# EAGLE design HIZ (EAGLE 7.3.0)
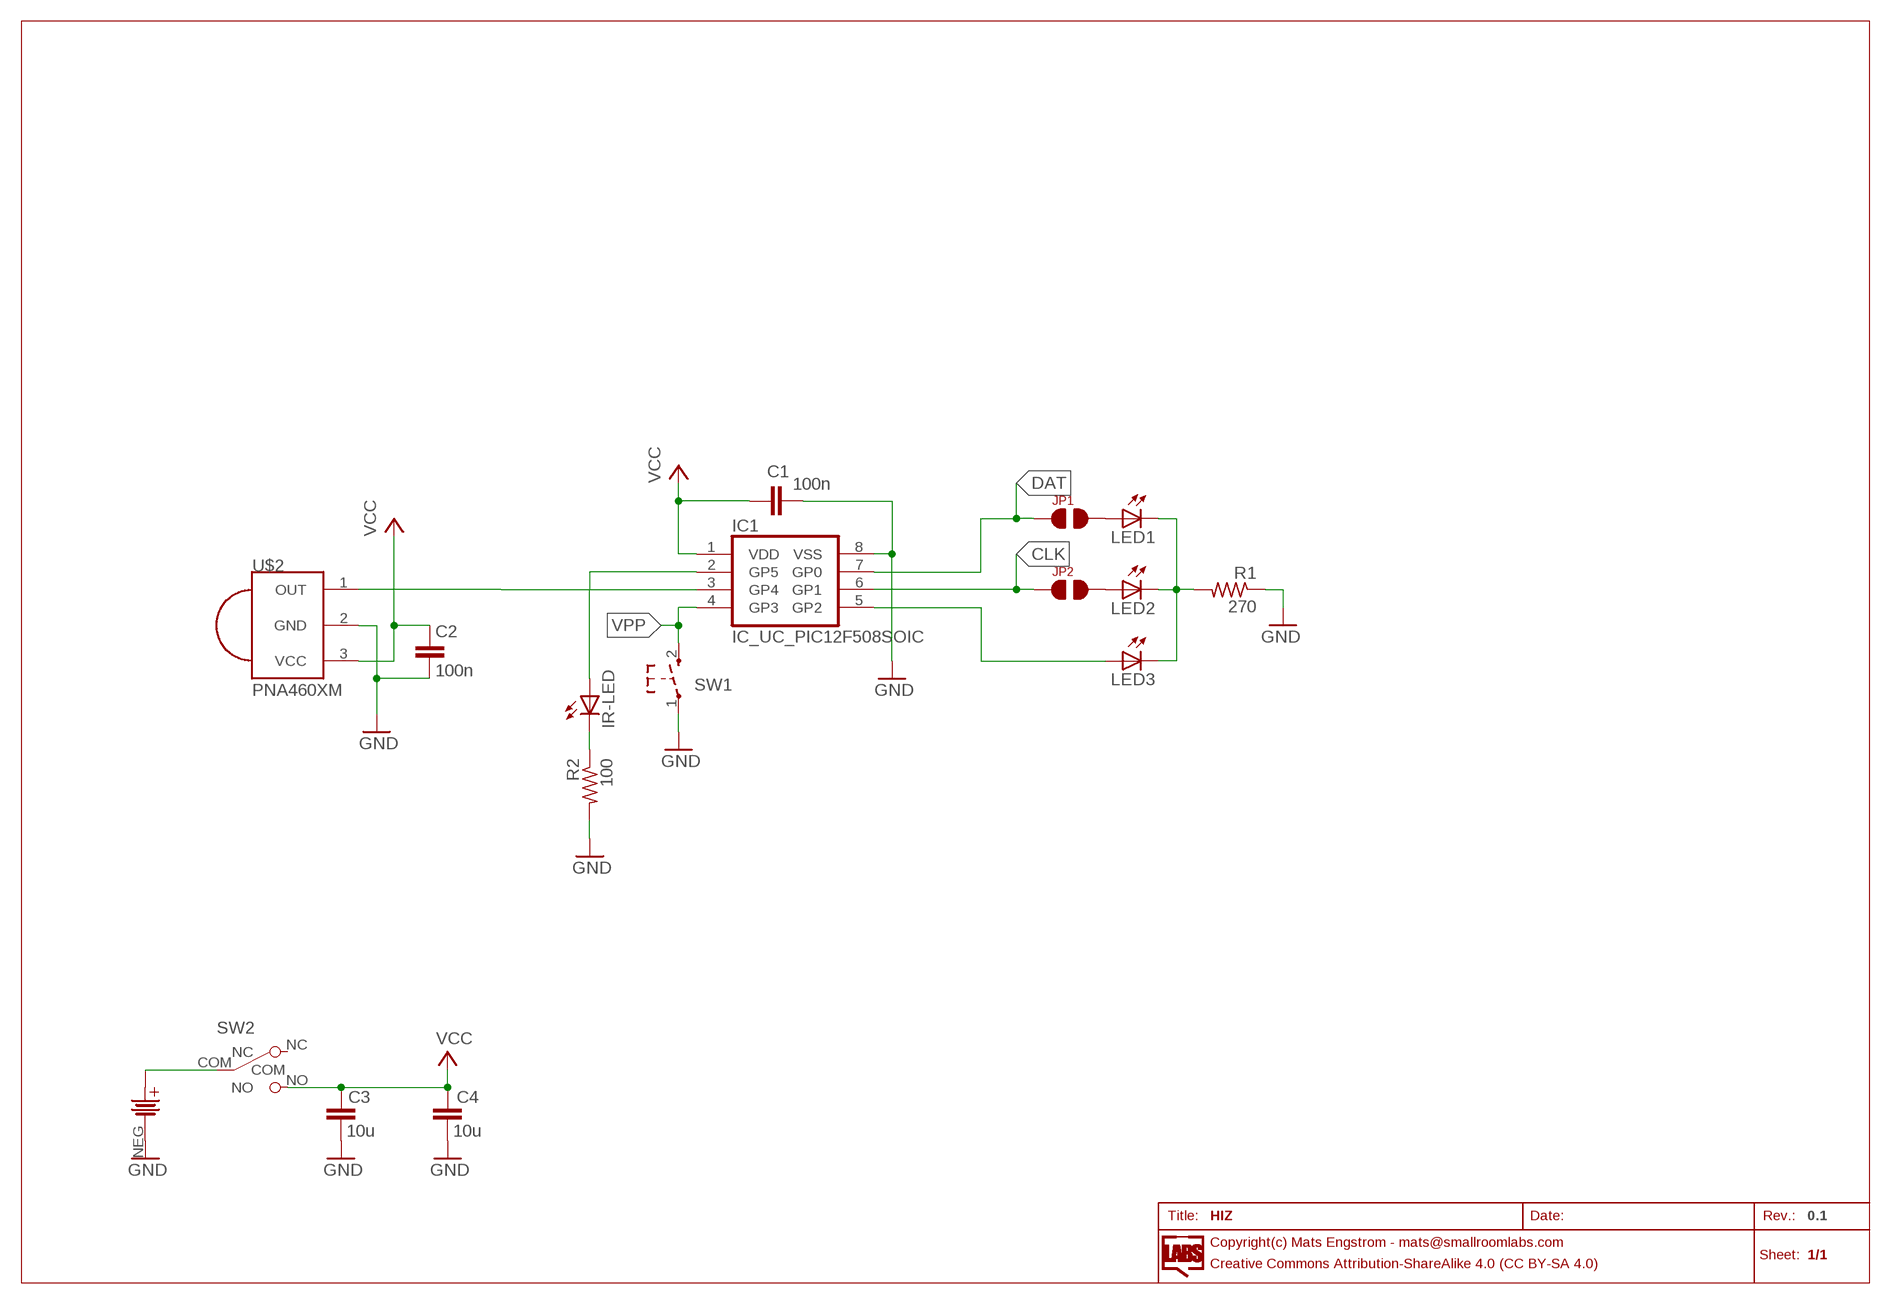
[diagram p0: schematic, sheet 1]

## Parts
BA1  BATTERY-3V2032PTH-CHEAP  [CR2032-PTH-CHEAP]
C1  100n  CAPACITOR_NPOL-0805  [C805]
C2  100n  CAPACITOR_NPOL-0805  [C805]
C3  10u  CAPACITOR_NPOL-0805  [C805]
C4  10u  CAPACITOR_NPOL-0805  [C805]
IC1  IC_UC_PIC12F508SOIC  [SO-8]
IR-LED  LEDSMT1206  [1206]
JP1  JP2-TINY  [JP2-T]
JP2  JP2-TINY  [JP2-T]
LED1  LED-0805  [LED-805]
LED2  LED-0805  [LED-805]
LED3  LED-0805  [LED-805]
R1  270  R-0805  [R0805]
R2  100  R-0805  [R0805]
SW1  SW_TACT_2P-3X6  [SW_TACT_3X6]
SW2  SW_SLIDE  [SLIDE_SWITCH_SMD]
U$2  PNA460XM  [PNA460XM]

## Nets
CLK: IC1.6(GP1) JP2.P$1
DAT: IC1.7(GP0) JP1.P$1
GND: BA1.NEG(MINUS) C1.2 C2.2 C3.2 C4.2 IC1.8(VSS) R1.1 R2.2 SW1.1 U$2.2(GND)
N$1: LED1.C LED2.C LED3.C R1.2
N$2: JP1.P$2 LED1.A
N$3: JP2.P$2 LED2.A
N$4: IC1.5(GP2) LED3.A
N$5: BA1.POS@1(PLUS) BA1.POS@2(PLUS) BA1.POS@3(PLUS) BA1.POS@4(PLUS) SW2.COM
N$6: IC1.3(GP4) U$2.1(OUT)
N$7: IR-LED.C R2.1
N$8: IC1.2(GP5) IR-LED.A
VCC: C1.1 C2.1 C3.1 C4.1 IC1.1(VDD) SW2.NO U$2.3(VCC)
VPP: IC1.4(GP3) SW1.2
Unconnected: SW2.NC

## Library data of the parts
BA1 = SmallRoomLabs_Battery:BATTERY-3V
C1-C4 = dp_devices:CAPACITOR_NPOL: Non-Polarized capacitor in various packages
IC1 = dp_devices:IC_UC_PIC12F508
IR-LED = adafruit:LED: LED OSRAM: - CHIPLED LG R971, LG N971, LY N971, LG Q971, LY Q971, LO R971, LY R971 LH N974, LH R974 LS Q976, LO Q976, LY Q976 LO Q996 - Hyper CHIPLED LW Q18S LB Q993, LB Q99A, LB R99A - SideLED LS A670, LO A670, LY A670, LG A670, LP A670 LB A673, LV A673, LT A673, LW A673 LH A674 LY A675 LS A676, LA A676, LO A676, LY A676, LW A676 LS A679, LY A679, LG A679 - Hyper Micro SIDELED® LS Y876, LA Y876, LO Y876, LY Y876 LT Y87S - SmartLED LW L88C, LW L88S LB L89C, LB L89S, LG L890 LS L89K, LO L89K, LY L89K LS L896, LA L896, LO L896, LY L896 - TOPLED LS T670, LO T670, LY T670, LG T670, LP T670 LSG T670, LSP T670, LSY T670, LOP T670, LYG T670 LG T671, LOG T671, LSG T671 LB T673, LV T673, LT T673, LW T673 LH T674 LS T676, LA T676, LO T676, LY T676, LB T676, LH T676, LSB T676, LW T676 LB T67C, LV T67C, LT T67C, LS T67K, LO T67K, LY T67K, LW E67C LS E67B, LA E67B, LO E67B, LY E67B, LB E67C, LV E67C, LT E67C LW T67C LS T679, LY T679, LG T679 LS T770, LO T770, LY T770, LG T770, LP T770 LB T773, LV T773, LT T773, LW T773 LH T774 LS E675, LA E675, LY E675, LS T675 LS T776, LA T776, LO T776, LY T776, LB T776 LHGB T686 LT T68C, LB T68C - Hyper Mini TOPLED® LB M676 - Mini TOPLED Santana® LG M470 LS M47K, LO M47K, LY M47K Source: http://www.osram.convergy.de/
JP1 JP2 = SmallRoomLabs_ConSwitch:JP2
LED1-LED3 = dp_devices:LED: Light Emitting Diode
R1 R2 = SmallRoomLabs_Discrete:R
SW1 = dp_devices:SW_TACT_2P
SW2 = dp_devices:SW_SLIDE
U$2 = adafruit:PNA460XM: IR 38KHz receiver PNA4602 and related receivers http://www.ladyada.net/library/pcb/eaglelibrary.html

## Board
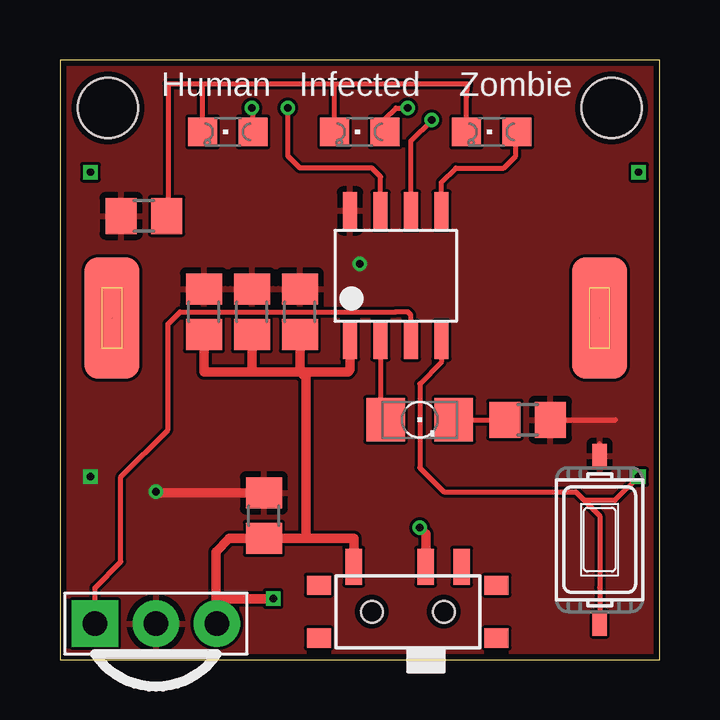
[diagram p1: board, top side]
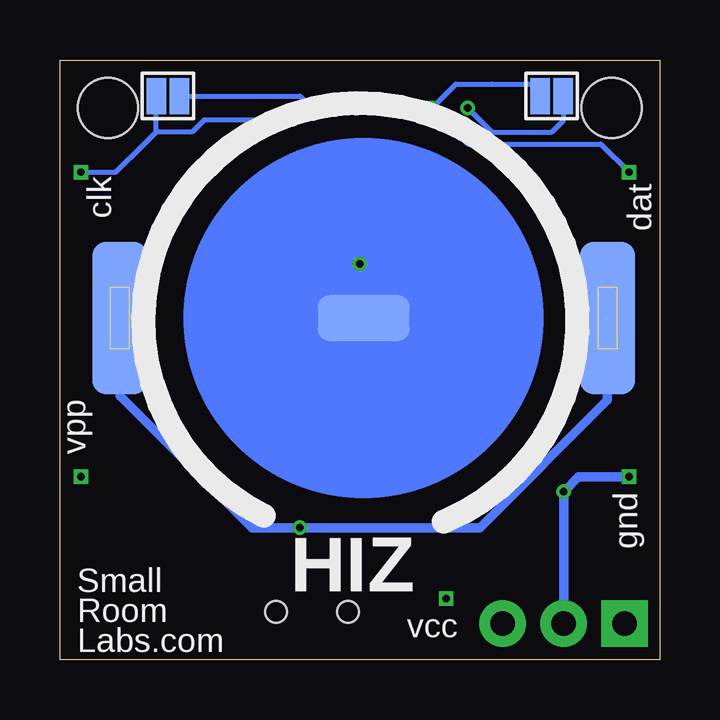
[diagram p2: board, bottom side, seen from below]

Size 25 x 25 mm. Coordinates in mm from the lower left corner, seen from the top.
Outline: 0,0 25,0 25,25 0,25 0,0
Copper layers (1*16): Top 0.035mm / dielectric 1.5mm / Bottom 0.035mm
Design rules "dirt_cheap_dirty_boards.v1": minimum track width 5mil, minimum drill 12mil, track to track 5mil, track to pad 5mil, pad to pad 5mil, via to via 5mil, smd to smd 0mil, copper to edge 10mil, drill to drill 10mil, minimum pad ring 10mil, minimum via ring 6mil, stop-mask expansion 2mil, vias tented up to drill 25mil, thermal gap 10mil
Holes 2.5 mm at 2,23 23,23

### Footprints (pad centres in the part's own frame; a part is rotated, then mirrored left to right if it is on the bottom)
CR2032-PTH-CHEAP = smd 3.81 x 1.905: NEG -0.334,0.239 | smd 2.3 x 5.08 bottom: POS@1 -10.494,0.239; POS@4 9.826,0.239 | smd 2.3 x 6.35: POS@2 -10.494,0.239; POS@3 9.826,0.239
C805 = smd 1.3 x 1.5: 1 -0.95,0; 2 0.95,0
SO-8 = smd 0.6 x 1.55: 1 -1.905,-2.69; 2 -0.635,-2.69; 3 0.635,-2.69; 4 1.905,-2.69; 5 1.905,2.71; 6 0.635,2.71; 7 -0.635,2.71; 8 -1.905,2.71
1206 = smd 1.6 x 1.803: A -1.422,0; C 1.422,0
JP2-T = smd 0.8 x 1.5: P$1 -0.483,0; P$2 0.483,0
LED-805 = smd 1.2 x 1.2: A 0,-1.05; C 0,1.05
R0805 = smd 1.3 x 1.5: 1 -0.95,0; 2 0.95,0
SW_TACT_3X6 = smd 1 x 0.6: 1 -3.5,0; 2 3.5,0
SLIDE_SWITCH_SMD = smd 0.7 x 1.5: COM 0.75,1.875; NC 2.25,1.875; NO -2.25,1.875 | smd 1 x 0.8: P$1 -3.7,-1.1; P$2 -3.7,1.1; P$3 3.7,1.1; P$4 3.7,-1.1 | hole 0.9: -1.5,0; 1.5,0
PNA460XM = drill 1.016 pad 1.93 square: 1 -2.54,0 | drill 1.016 pad 1.93: 2 0,0; 3 2.54,0

### Placement (x,y rotation side)
BA1  12,14 0 bottom
C1  10,14.5 90 top
C2  8.5,6 90 top
C3  8,14.5 90 top
C4  6,14.5 90 top
IC1  14,16 0 top
IR-LED  15,10 0 top
JP1  4.5,23.5 0 bottom
JP2  20.5,23.5 0 bottom
LED1  7,22 90 top
LED2  12.5,22 90 top
LED3  18,22 90 top
R1  3.5,18.5 0 top
R2  19.5,10 0 top
SW1  22.5,5 270 top
SW2  14.5,2 0 top
U$2  4,1.5 0 top

### Tracks (layer width: path | path; a pad name or v marks a point on that pad's centre or on a via)
CLK  (via drill 0.3)
  Top 0.203: IC1.6 14.63,21.64 v15.5,22.5
  Bottom 0.203: 21,22 20,22 19.5,22 19,22.5 v15.5,22.5 | 21,22 21,23 21,23.48 JP2.P$1 21,23.52 | 21,22 21.5,21.5 22.68,20.32 v24.13,20.32
DAT  (via drill 0.3)
  Top 0.203: IC1.7 13.37,20.14 13,20.5 10,20.5 9.5,21 v9.5,23
  Bottom 0.203: JP1.P$1 5,23.52 5,24 5.48,24 7,24 8.5,24 v9.5,23 8,21.5 2.45,21.5 v1.27,20.32
GND  (via drill 0.3)
  Top 0.203: 22.5,9 SW1.1 | R2.2 23.17,10
  Top 0.4: C2.2 4.05,6.95 v4,7
  Bottom 0.4: U$2.2 v4,7 3.38,7.62 v1.27,7.62 | v12.5,16.5 12.5,14.4 BA1.NEG
  pour Top: 0,25 25,25 25,0 0,0
N$1
  Top 0.203: LED3.C 16.95,23.45 17,24 11.5,24 | 11.5,24 6,24 | 6,24 4.5,24 4.5,18.55 R1.2 | LED2.C 11.45,23.95 11.5,24 | LED1.C 5.95,23.95 6,24
N$2  (via drill 0.3)
  Top 0.203: LED1.A 8.05,22.95 v8,23
  Bottom 0.203: v8,23 7,22 4.5,22 4,22.5 4,23.48 JP1.P$2
N$3  (via drill 0.3)
  Top 0.203: LED2.A 13.55,22.55 14,23 v14.5,23
  Bottom 0.203: JP2.P$2 15,23.5 v14.5,23
N$4
  Top 0.203: IC1.5 15.9,19.91 16.5,20.5 18.5,20.5 19,21 19,21.95 LED3.A
N$5  (via drill 0.3)  (2 unrouted)
  Top 0.4: SW2.COM 15.25,5.25 v15,5.5
  Bottom 0.4: BA1.POS@3 2.17,10.83 7.5,5.5 v15,5.5 17,5.5 22.49,10.99 BA1.POS@2
N$6
  Top 0.203: U$2.1 1.46,3 2.54,4.08 2.54,7.62 4.5,9.58 4.5,12 4.5,14 5,14.5 14,14.5 14.5,14.5 14.63,14.37 IC1.3
N$7
  Top 0.203: IR-LED.C R2.1
N$8
  Top 0.203: IC1.2 13.37,10.21 IR-LED.A
VCC  (via drill 0.3)
  Top 0.4: C4.1 6,12 8,12 | 8,12 10,12 | 10,12 12,12 12.1,12.1 IC1.1 | C1.1 10,12 | C3.1 8,12 | 10,12 10.25,11.75 10.25,8.25 10.25,6 10.25,5.05 10,5.05 | 10,5.05 C2.1 7.05,5.05 6.5,4.5 6.5,2.54 | 6.5,2.54 6.5,1.54 U$2.3 | 10,5.05 12.25,5.05 SW2.NO | v8.89,2.54 6.5,2.54
VPP  (via drill 0.3)
  Top 0.203: IC1.4 15.9,12.4 15,11.5 15,8 16,7 21.5,7 21.87,6.63 | 21.87,6.63 22.5,6 22.5,3 SW1.2 | v24.13,7.62 23.14,6.63 21.87,6.63

### Text on the board
tPlace: Human | Infected | Zombie
bPlace: dat | clk | vpp | gnd | HIZ | Small / Room / Labs.com | vcc